# EAGLE design ADC1 (EAGLE 9.6.2)
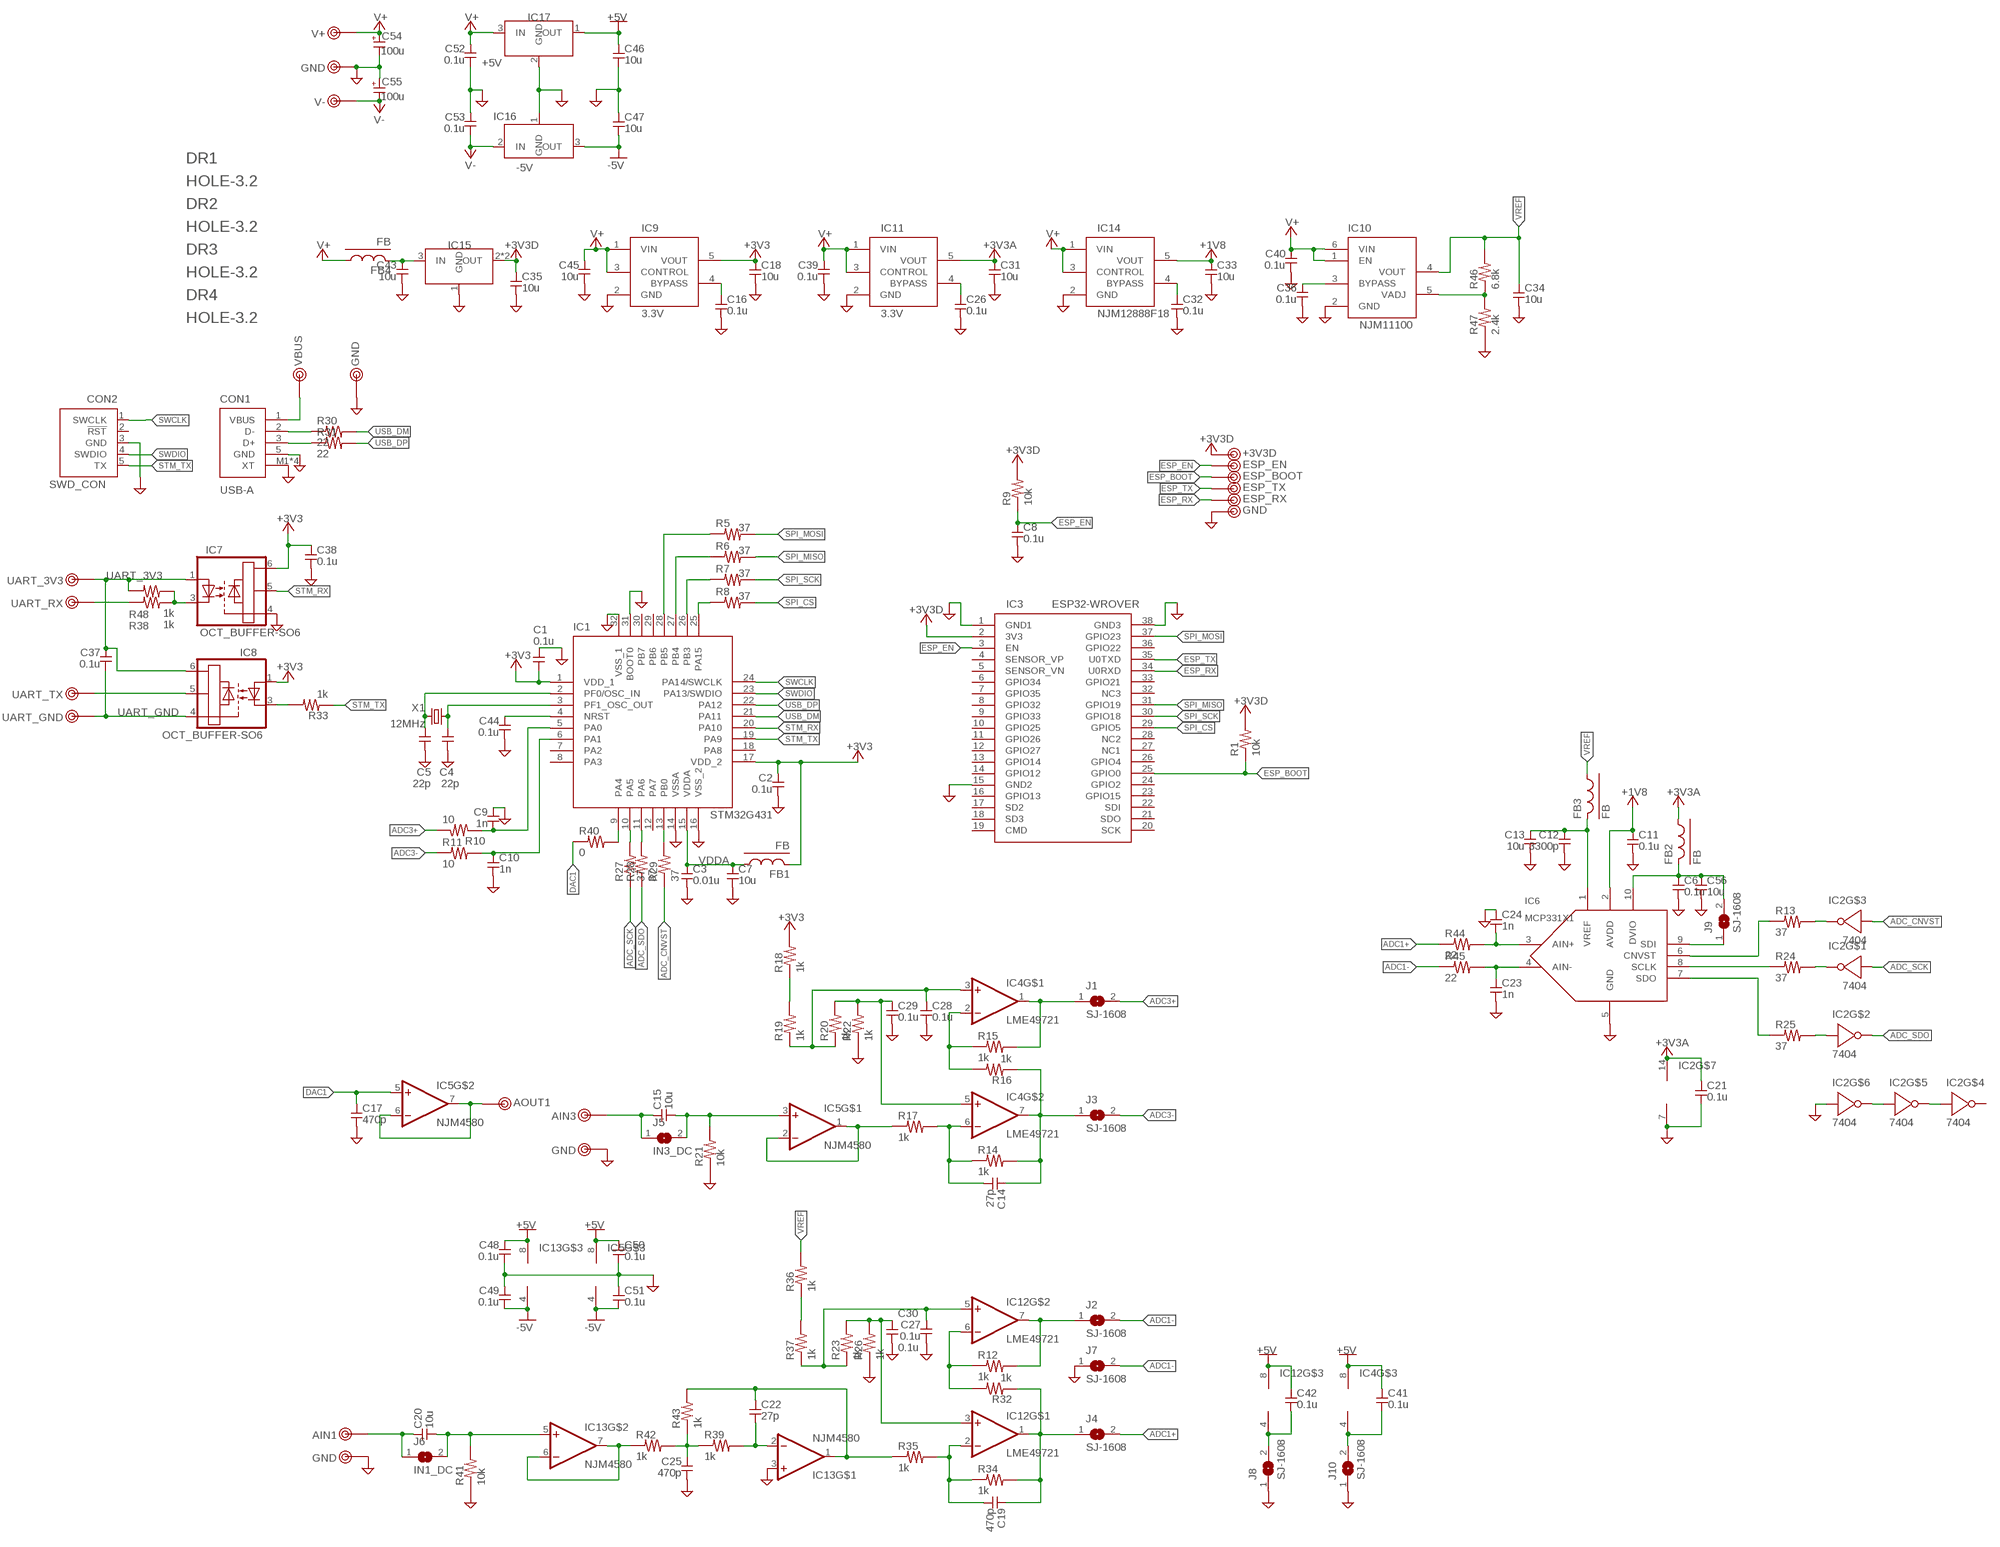
[diagram p0: schematic, sheet 1]

## Parts
C1  0.1u  C-1608  [1608]
C2  0.1u  C-1608  [1608]
C3  0.01u  C-1608  [1608]
C4  22p  C-1608  [1608]
C5  22p  C-1608  [1608]
C6  0.1u  C-1608  [1608]
C7  10u  C-2012  [2012]
C8  0.1u  C-1608  [1608]
C9  1n  C-1608  [1608]
C10  1n  C-1608  [1608]
C11  0.1u  C-1608  [1608]
C12  3300p  C-1608  [1608]
C13  10u  C-2012  [2012]
C14  27p  C-1608  [1608]
C15  10u  C-3225  [3225]
C16  0.1u  C-1608  [1608]
C17  470p  C-1608  [1608]
C18  10u  C-2012  [2012]
C19  470p  C-1608  [1608]
C20  10u  C-3225  [3225]
C21  0.1u  C-1608  [1608]
C22  27p  C-1608  [1608]
C23  1n  C-1608  [1608]
C24  1n  C-1608  [1608]
C25  470p  C-1608  [1608]
C26  0.1u  C-1608  [1608]
C27  0.1u  C-1608  [1608]
C28  0.1u  C-1608  [1608]
C29  0.1u  C-1608  [1608]
C30  0.1u  C-1608  [1608]
C31  10u  C-2012  [2012]
C32  0.1u  C-1608  [1608]
C33  10u  C-2012  [2012]
C34  10u  C-2012  [2012]
C35  10u  C-2012  [2012]
C36  0.1u  C-1608  [1608]
C37  0.1u  C-1608  [1608]
C38  0.1u  C-1608  [1608]
C39  0.1u  C-1608  [1608]
C40  0.1u  C-1608  [1608]
C41  0.1u  C-1608  [1608]
C42  0.1u  C-1608  [1608]
C43  10u  C-2012  [2012]
C44  0.1u  C-1608  [1608]
C45  10u  C-2012  [2012]
C46  10u  C-2012  [2012]
C47  10u  C-2012  [2012]
C48  0.1u  C-1608  [1608]
C49  0.1u  C-1608  [1608]
C50  0.1u  C-1608  [1608]
C51  0.1u  C-1608  [1608]
C52  0.1u  C-1608  [1608]
C53  0.1u  C-1608  [1608]
C54  100u  CPOLE2.5-8  [E2,5-8]
C55  100u  CPOLE2.5-8  [E2,5-8]
C56  10u  C-2012  [2012]
CON1  USB-A  [UX60A-MB-5ST]
CON2  SWD_CON  [SWD_CON]
DR1  HOLE-3.2  [HOLE_3.2]
DR2  HOLE-3.2  [HOLE_3.2]
DR3  HOLE-3.2  [HOLE_3.2]
DR4  HOLE-3.2  [HOLE_3.2]
FB1  FB  [1608-J]
FB2  FB  [1608-J]
FB3  FB  [1608-J]
FB4  FB  [1608-J]
IC1  STM32G431  STM32G431KB  [TQFP32-08]
IC2  7404  [TSSOP14]
IC3  ESP32-WROVER  [ESP32-WROVER]
IC4  LME49721  OPA-2-SOP  [SOP8]
IC5  NJM4580  OPA-2-SOP  [SOP8]
IC6  MCP331X1  [MSOP10]
IC7  OCT_BUFFER-SO6  [SO6]
IC8  OCT_BUFFER-SO6  [SO6]
IC9  3.3V  TAR5SB33  [SOT23-5]
IC10  NJM11100  [SOT23-6]
IC11  3.3V  TAR5SB33  [SOT23-5]
IC12  LME49721  OPA-2-SOP  [SOP8]
IC13  NJM4580  OPA-2-SOP  [SOP8]
IC14  NJM12888F18  NJM12888  [SOT23-5]
IC15  LM1117GS  [SOT223]
IC16  -5V  79LX  [TO-92]
IC17  +5V  78LX  [TO-92]
J1  SJ-1608  [1608-J]
J2  SJ-1608  [1608-J]
J3  SJ-1608  [1608-J]
J4  SJ-1608  [1608-J]
J5  IN3_DC  SJ-2012  [2012-J]
J6  IN1_DC  SJ-2012  [2012-J]
J7  SJ-1608  [1608-J]
J8  SJ-1608  [1608-J]
J9  SJ-1608  [1608-J]
J10  SJ-1608  [1608-J]
R1  10k  R-1608  [1608]
R5  37  R-1608J  [1608-J]
R6  37  R-1608J  [1608-J]
R7  37  R-1608J  [1608-J]
R8  37  R-1608J  [1608-J]
R9  10k  R-1608  [1608]
R10  10  R-1608  [1608]
R11  10  R-1608  [1608]
R12  1k  R-1608  [1608]
R13  37  R-1608J  [1608-J]
R14  1k  R-1608  [1608]
R15  1k  R-1608  [1608]
R16  1k  R-1608  [1608]
R17  1k  R-1608  [1608]
R18  1k  R-1608  [1608]
R19  1k  R-1608  [1608]
R20  1k  R-1608  [1608]
R21  10k  R-1608  [1608]
R22  1k  R-1608  [1608]
R23  1k  R-1608  [1608]
R24  37  R-1608J  [1608-J]
R25  37  R-1608J  [1608-J]
R26  1k  R-1608  [1608]
R27  37  R-1608J  [1608-J]
R28  37  R-1608J  [1608-J]
R29  37  R-1608J  [1608-J]
R30  22  R-1608  [1608]
R31  22  R-1608  [1608]
R32  1k  R-1608  [1608]
R33  1k  R-1608  [1608]
R34  1k  R-1608  [1608]
R35  1k  R-1608  [1608]
R36  1k  R-1608  [1608]
R37  1k  R-1608  [1608]
R38  1k  R-1608  [1608]
R39  1k  R-1608  [1608]
R40  0  R-1608J  [1608-J]
R41  10k  R-1608  [1608]
R42  1k  R-1608  [1608]
R43  1k  R-1608  [1608]
R44  22  R-1608  [1608]
R45  22  R-1608  [1608]
R46  6.8k  R-1608  [1608]
R47  2.4k  R-1608  [1608]
R48  1k  R-1608  [1608]
TP1  AIN3  TESTPIN-BIG  [TESTPIN-BIG]
TP2  AIN1  TESTPIN-BIG  [TESTPIN-BIG]
TP3  AOUT1  TESTPIN-BIG  [TESTPIN-BIG]
TP4  VBUS  TESTPIN  [TESTPIN]
TP5  UART_3V3  TESTPIN  [TESTPIN]
TP6  UART_RX  TESTPIN  [TESTPIN]
TP7  UART_GND  TESTPIN  [TESTPIN]
TP8  UART_TX  TESTPIN  [TESTPIN]
TP9  +3V3D  TESTPIN  [TESTPIN]
TP10  ESP_EN  TESTPIN  [TESTPIN]
TP11  ESP_BOOT  TESTPIN  [TESTPIN]
TP12  ESP_TX  TESTPIN  [TESTPIN]
TP13  GND  TESTPIN  [TESTPIN]
TP14  ESP_RX  TESTPIN  [TESTPIN]
TP15  GND  TESTPIN-BIG  [TESTPIN-BIG]
TP16  GND  TESTPIN-BIG  [TESTPIN-BIG]
TP17  V+  TESTPIN-BIG  [TESTPIN-BIG]
TP18  GND  TESTPIN-BIG  [TESTPIN-BIG]
TP19  V-  TESTPIN-BIG  [TESTPIN-BIG]
TP20  GND  TESTPIN  [TESTPIN]
X1  12MHz  CRYSTALHC49S  [HC49/S]

## Nets
+1V8: C11.1 C33.1 IC6.2(AVDD) IC14.5(VOUT)
+3V3: C1.2 C2.1 C18.1 C38.1 FB1.2 IC1.1(VDD_1) IC1.17(VDD_2) IC7.6(V+) IC8.1(A) IC9.5(VOUT) R18.2
+3V3A: C21.1 C31.1 FB2.1 IC2.14(V+) IC11.5(VOUT)
+3V3D: C35.1 IC3.2(3V3) IC15.2(OUT) IC15.4(OUT) R1.2 R9.2 TP9.1
+5V: C41.1 C42.1 C46.1 C48.1 C50.1 IC4.8(V+) IC5.8(V+) IC12.8(V+) IC13.8(V+) IC17.1(OUT)
-5V: C47.2 C49.2 C51.2 IC5.4(V-) IC13.4(V-) IC16.3(OUT)
ADC1+: J4.2 R44.1
ADC1-: J2.2 J7.2 R45.1
ADC3+: J1.2 R10.1
ADC3-: J3.2 R11.1
ADC_CNVST: IC2.5(IN) R29.1
ADC_SCK: IC2.1(IN) R27.1
ADC_SDO: IC2.4(OUT) R28.1
DAC1: C17.1 IC5.5(+IN) R40.1
ESP_BOOT: IC3.25(GPIO0) R1.1 TP11.1
ESP_EN: C8.1 IC3.3(EN) R9.1 TP10.1
ESP_RX: IC3.34(U0RXD) TP14.1
ESP_TX: IC3.35(U0TXD) TP12.1
GND: C1.1 C2.2 C3.2 C4.2 C5.2 C6.2 C7.2 C8.2 C9.1 C10.2 C11.2 C12.2 C13.2 C16.2 C17.2 C18.2 C21.2 C23.2 C24.1 C25.2 C26.2 C27.2 C28.2 C29.2 C30.2 C31.2 C32.2 C33.2 C34.2 C35.2 C36.2 C38.2 C39.2 C40.2 C43.2 C44.2 C45.2 C46.2 C47.1 C48.2 C49.1 C50.2 C51.1 C52.2 C53.1 C54.- C55.+ C56.2 CON1.5(GND) CON1.M1(XT) CON1.M2(XT) CON1.M3(XT) CON1.M4(XT) CON2.3(GND) IC1.14(VSSA) IC1.16(VSS_2) IC1.31(BOOT0) IC1.32(VSS_1) IC2.7(V-) IC2.13(IN) IC3.1(GND1) IC3.15(GND2) IC3.38(GND3) IC6.5(GND) IC7.4(GND) IC9.2(GND) IC10.2(GND) IC11.2(GND) IC13.3(+IN) IC14.2(GND) IC15.1(GND) IC16.1(GND) IC17.2(GND) J7.1 J8.1 J10.1 R21.1 R22.1 R26.1 R41.1 R47.1 TP13.1 TP15.1 TP16.1 TP18.1 TP20.1
N$1: C5.1 IC1.2(PF0/OSC_IN) X1.2
N$2: C9.2 IC1.5(PA0) R10.2
N$3: C4.1 IC1.3(PF1_OSC_OUT) X1.1
N$4: C25.1 R39.1 R42.2 R43.1
N$5: C10.1 IC1.6(PA1) R11.2
N$6: IC1.26(PB3) R7.1
N$7: IC1.27(PB4) R6.1
N$8: IC1.28(PB5) R5.1
N$9: IC1.13(PB0) R29.2
N$10: C15.1 J5.1 TP1.1
N$11: IC2.11(IN) IC2.12(OUT)
N$12: IC2.9(IN) IC2.10(OUT)
N$14: C28.1 IC4.3(+IN) R19.1 R20.1
N$15: C6.1 C56.1 FB2.2 IC6.10(DVIO) J9.2
N$16: C12.1 C13.1 FB3.2 IC6.1(VREF)
N$17: IC1.25(PA15) R8.1
N$18: IC4.2(-IN) R15.1 R16.2
N$19: IC2.6(OUT) R13.2
N$20: IC2.3(IN) R25.2
N$21: C14.2 IC4.6(-IN) R14.1 R17.2
N$22: C15.2 IC5.3(+IN) J5.2 R21.2
N$23: IC5.1(OUT) IC5.2(-IN) R17.1
N$24: IC5.6(-IN) IC5.7(OUT) TP3.1
N$25: IC6.7(SDO) R25.1
N$26: IC4.1(OUT) J1.1 R15.2
N$27: C14.1 IC4.7(OUT) J3.1 R14.2 R16.1
N$28: IC6.8(SCLK) R24.1
N$29: IC6.6(CNVST) R13.1
N$30: IC6.9(SDI) J9.1
N$31: IC2.2(OUT) R24.2
N$32: CON1.2(D-) R30.1
N$33: CON1.3(D+) R31.1
N$34: IC8.3(C) R33.2
N$35: IC7.3(C) R38.2 R48.2
N$36: IC1.10(PA5) R27.2
N$37: IC1.11(PA6) R28.2
N$38: R36.1 R37.2
N$39: C29.1 IC4.5(+IN) R20.2 R22.2
N$40: R18.1 R19.2
N$41: C27.1 IC12.5(+IN) R23.1 R37.1
N$42: IC12.6(-IN) R12.1 R32.2
N$43: C19.2 IC12.2(-IN) R34.1 R35.2
N$44: C30.1 IC12.3(+IN) R23.2 R26.2
N$45: IC13.6(-IN) IC13.7(OUT) R42.1
N$46: IC12.7(OUT) J2.1 R12.2
N$47: C19.1 IC12.1(OUT) J4.1 R32.1 R34.2
N$48: C20.1 J6.1 TP2.1
N$49: C20.2 IC13.5(+IN) J6.2 R41.2
N$51: C16.1 IC9.4(BYPASS)
N$52: C24.2 IC6.3(AIN+) R44.2
N$53: C23.1 IC6.4(AIN-) R45.2
N$54: IC1.9(PA4) R40.2
N$55: C22.2 IC13.2(-IN) R39.2
N$56: C26.1 IC11.4(BYPASS)
N$57: C22.1 IC13.1(OUT) R35.1 R43.2
N$59: C32.1 IC14.4(BYPASS)
N$61: C36.1 IC10.3(BYPASS)
N$62: IC10.5(VADJ) R46.1 R47.2
N$63: C42.2 IC12.4(V-) J8.2
N$64: C41.2 IC4.4(V-) J10.2
N$65: C43.1 FB4.2 IC15.3(IN)
N$66: C44.1 IC1.4(NRST)
SPI_CS: IC3.29(GPIO5) R8.2
SPI_MISO: IC3.31(GPIO19) R6.2
SPI_MOSI: IC3.37(GPIO23) R5.2
SPI_SCK: IC3.30(GPIO18) R7.2
STM_RX: IC1.20(PA10) IC7.5(OUT)
STM_TX: CON2.5(TX) IC1.19(PA9) R33.1
SWCLK: CON2.1(SWCLK) IC1.24(PA14/SWCLK)
SWDIO: CON2.4(SWDIO) IC1.23(PA13/SWDIO)
UART_3V3: C37.1 IC7.1(A) IC8.6(V+) R48.1 TP5.1
UART_GND: C37.2 IC8.4(GND) TP7.1
UART_RX: R38.1 TP6.1
UART_TX: IC8.5(OUT) TP8.1
USB_DM: IC1.21(PA11) R30.2
USB_DP: IC1.22(PA12) R31.2
V+: C39.1 C40.1 C45.1 C52.1 C54.+ FB4.1 IC9.1(VIN) IC9.3(CONTROL) IC10.1(EN) IC10.6(VIN) IC11.1(VIN) IC11.3(CONTROL) IC14.1(VIN) IC14.3(CONTROL) IC17.3(IN) TP17.1
V-: C53.2 C55.- IC16.2(IN) TP19.1
VBUS: CON1.1(VBUS) TP4.1
VDDA: C3.1 C7.1 FB1.1 IC1.15(VDDA)
VREF: C34.1 FB3.1 IC10.4(VOUT) R36.2 R46.2
Unconnected: CON2.2(!RST) IC1.7(PA2) IC1.8(PA3) IC1.12(PA7) IC1.18(PA8) IC1.29(PB6) IC1.30(PB7) IC2.8(OUT) IC3.4(SENSOR_VP) IC3.5(SENSOR_VN) IC3.6(GPIO34) IC3.7(GPIO35) IC3.8(GPIO32) IC3.9(GPIO33) IC3.10(GPIO25) IC3.11(GPIO26) IC3.12(GPIO27) IC3.13(GPIO14) IC3.14(GPIO12) IC3.16(GPIO13) IC3.17(SD2) IC3.18(SD3) IC3.19(CMD) IC3.20(SCK) IC3.21(SDO) IC3.22(SDI) IC3.23(GPIO15) IC3.24(GPIO2) IC3.26(GPIO4) IC3.27(NC1) IC3.28(NC2) IC3.32(NC3) IC3.33(GPIO21) IC3.36(GPIO22)

## Library data of the parts
C1-C53 C56 = my_rcl:C
C54 C55 = my_rcl:CPOL
CON1 = my_connector:USB
CON2 = my_connector:SWD_CON
DR1-DR4 = my_connector:HOLE-3.2
FB1-FB4 = my_rcl:FB
IC1 = my_ic:STM32G431KB
IC2 = my_ic:7404
IC3 = my_ic:ESP32-WROVER
IC4 IC5 IC12 IC13 = my_ic:OPA-2
IC6 = my_ic:MCP331X1
IC7 IC8 = my_ic:OCT_BUFFER
IC9 IC11 = my_ic:TAR5SB33
IC10 = my_ic:NJM11100
IC14 = my_ic:NJM12888
IC15 = my_ic:LM1117GS
IC16 = my_ic:79LX
IC17 = my_ic:78LX
J1-J10 = my_rcl:SJ
R1 R5-R48 = my_rcl:R
TP1-TP20 = my_connector:TESTPIN
X1 = my_rcl:CRYSTAL: CRYSTAL

## Board
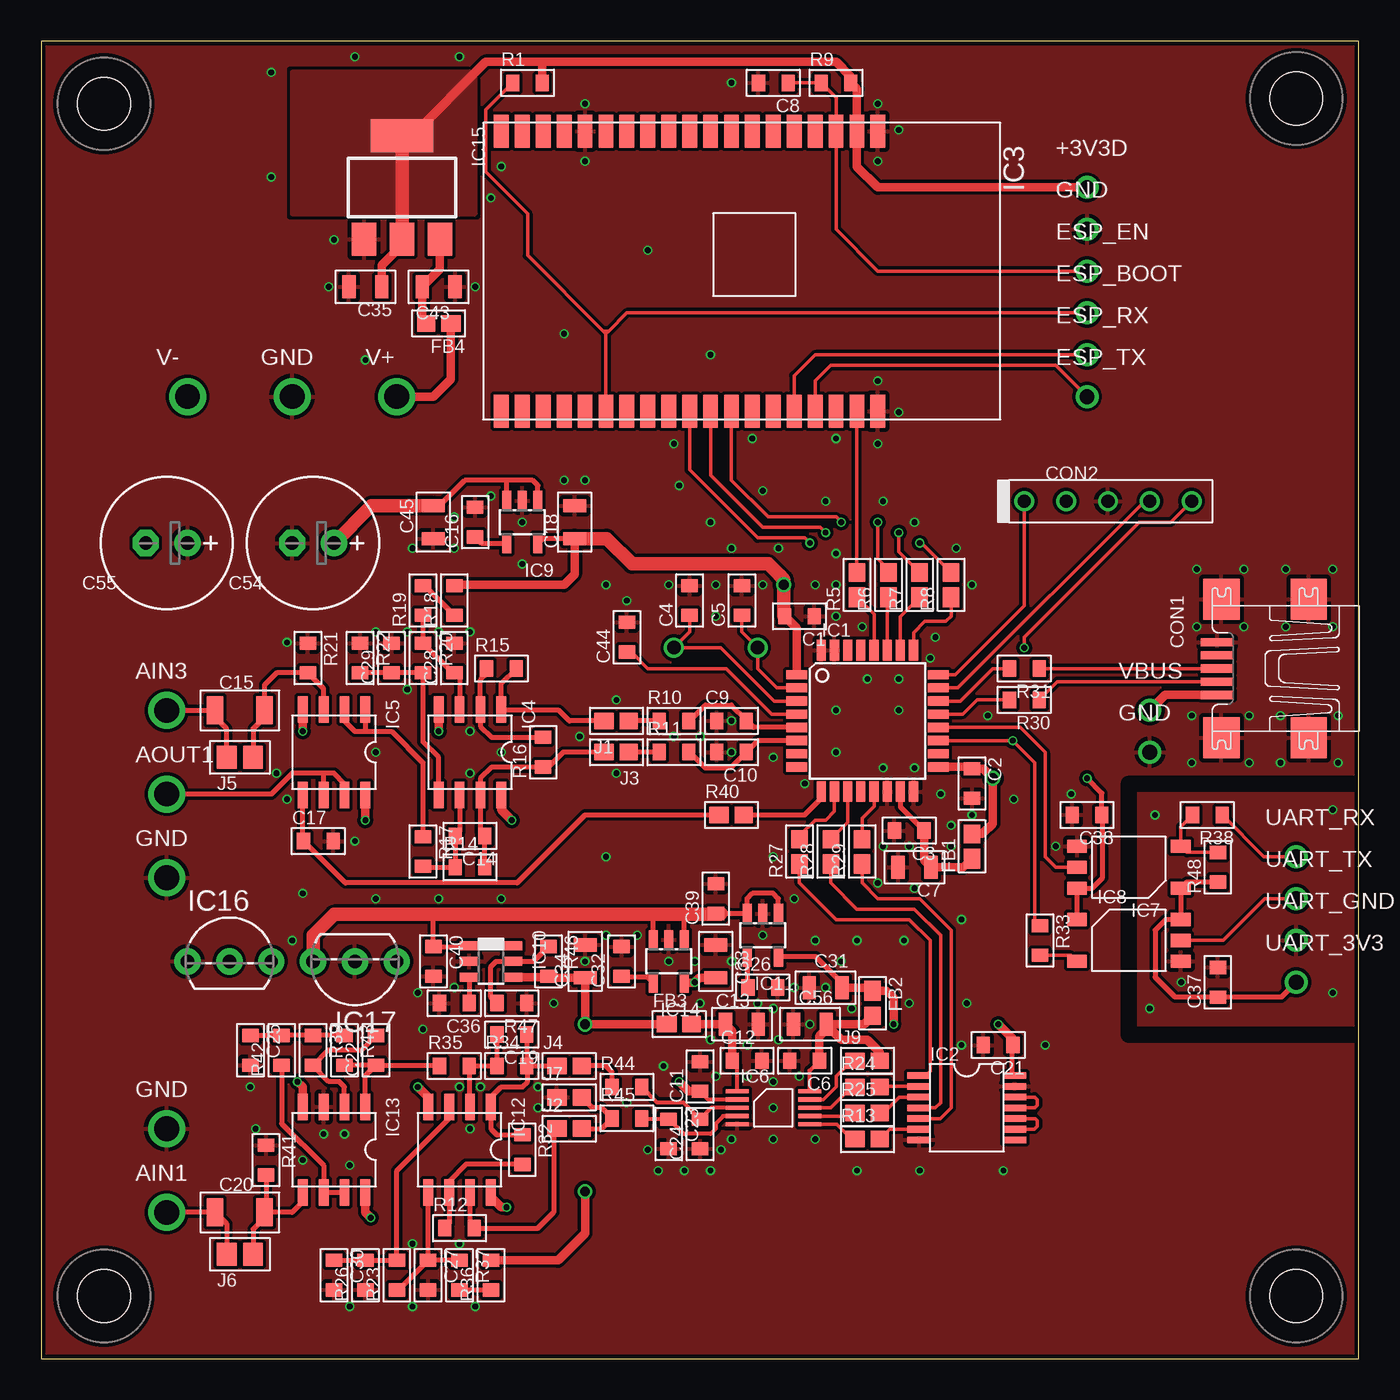
[diagram p1: board, top side]
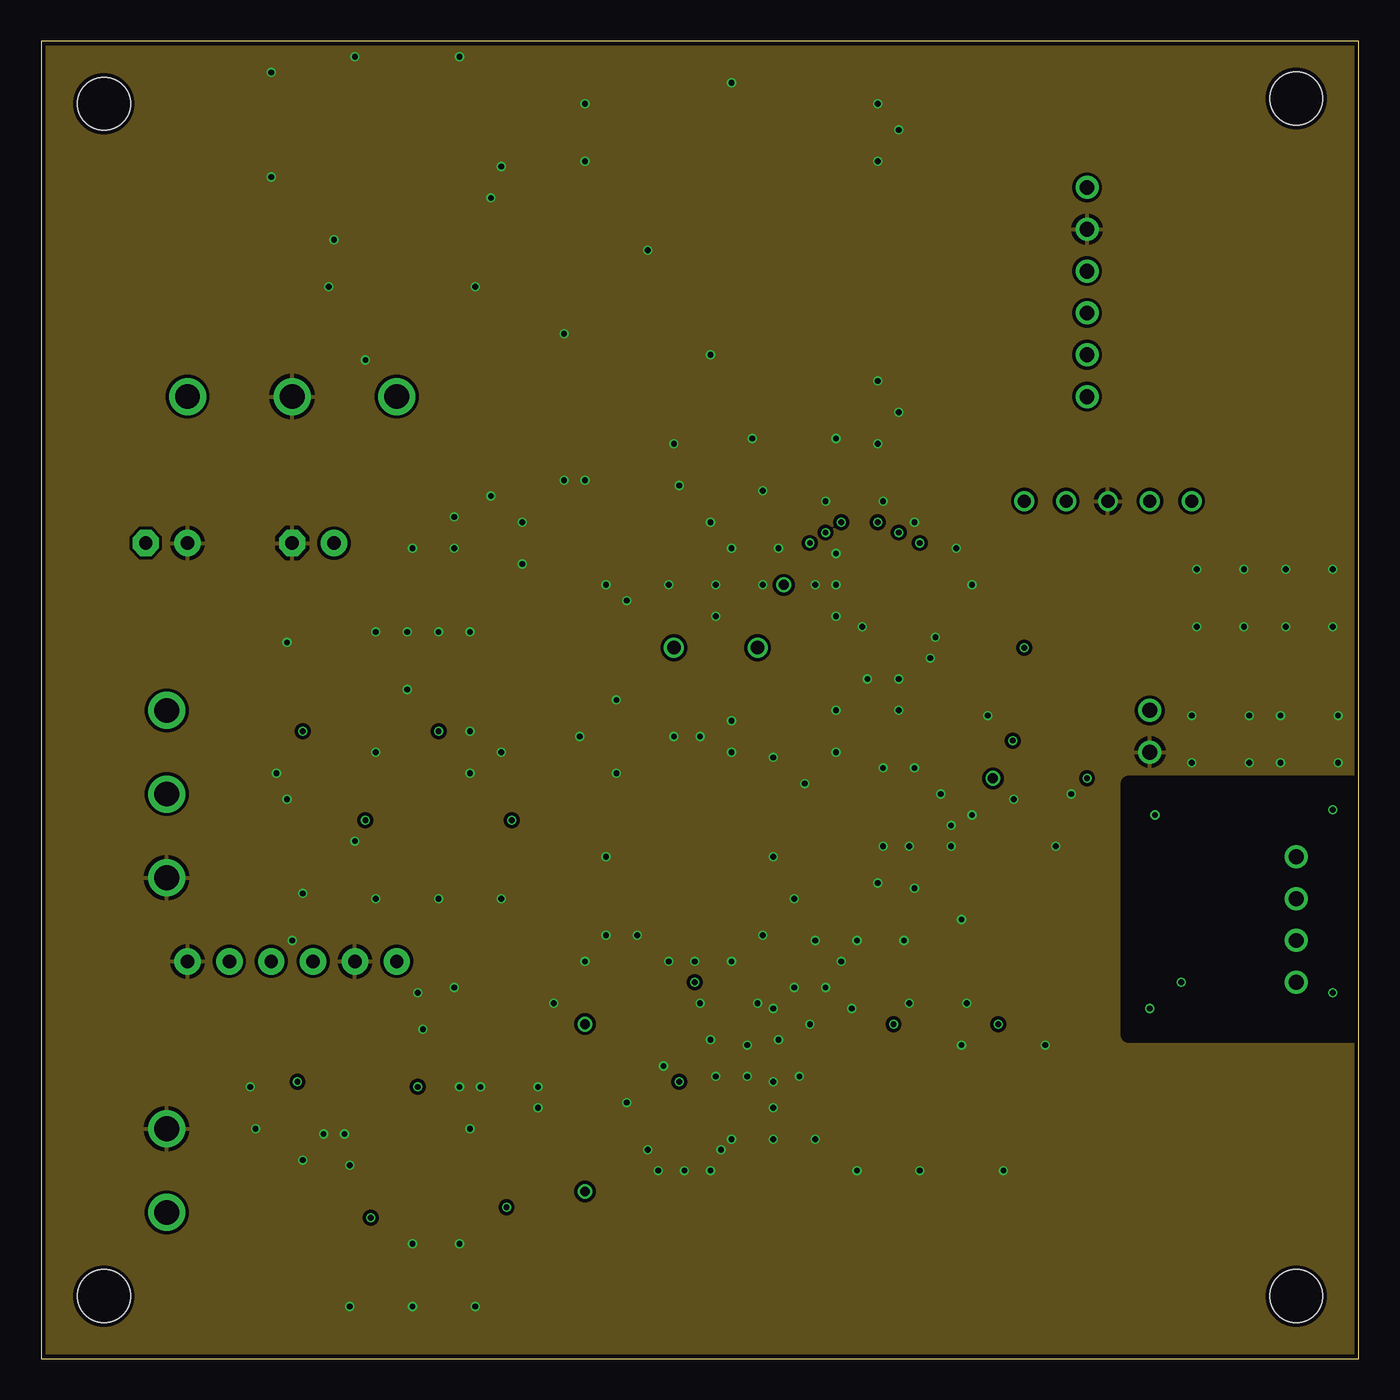
[diagram p2: board, inner layer Route2]
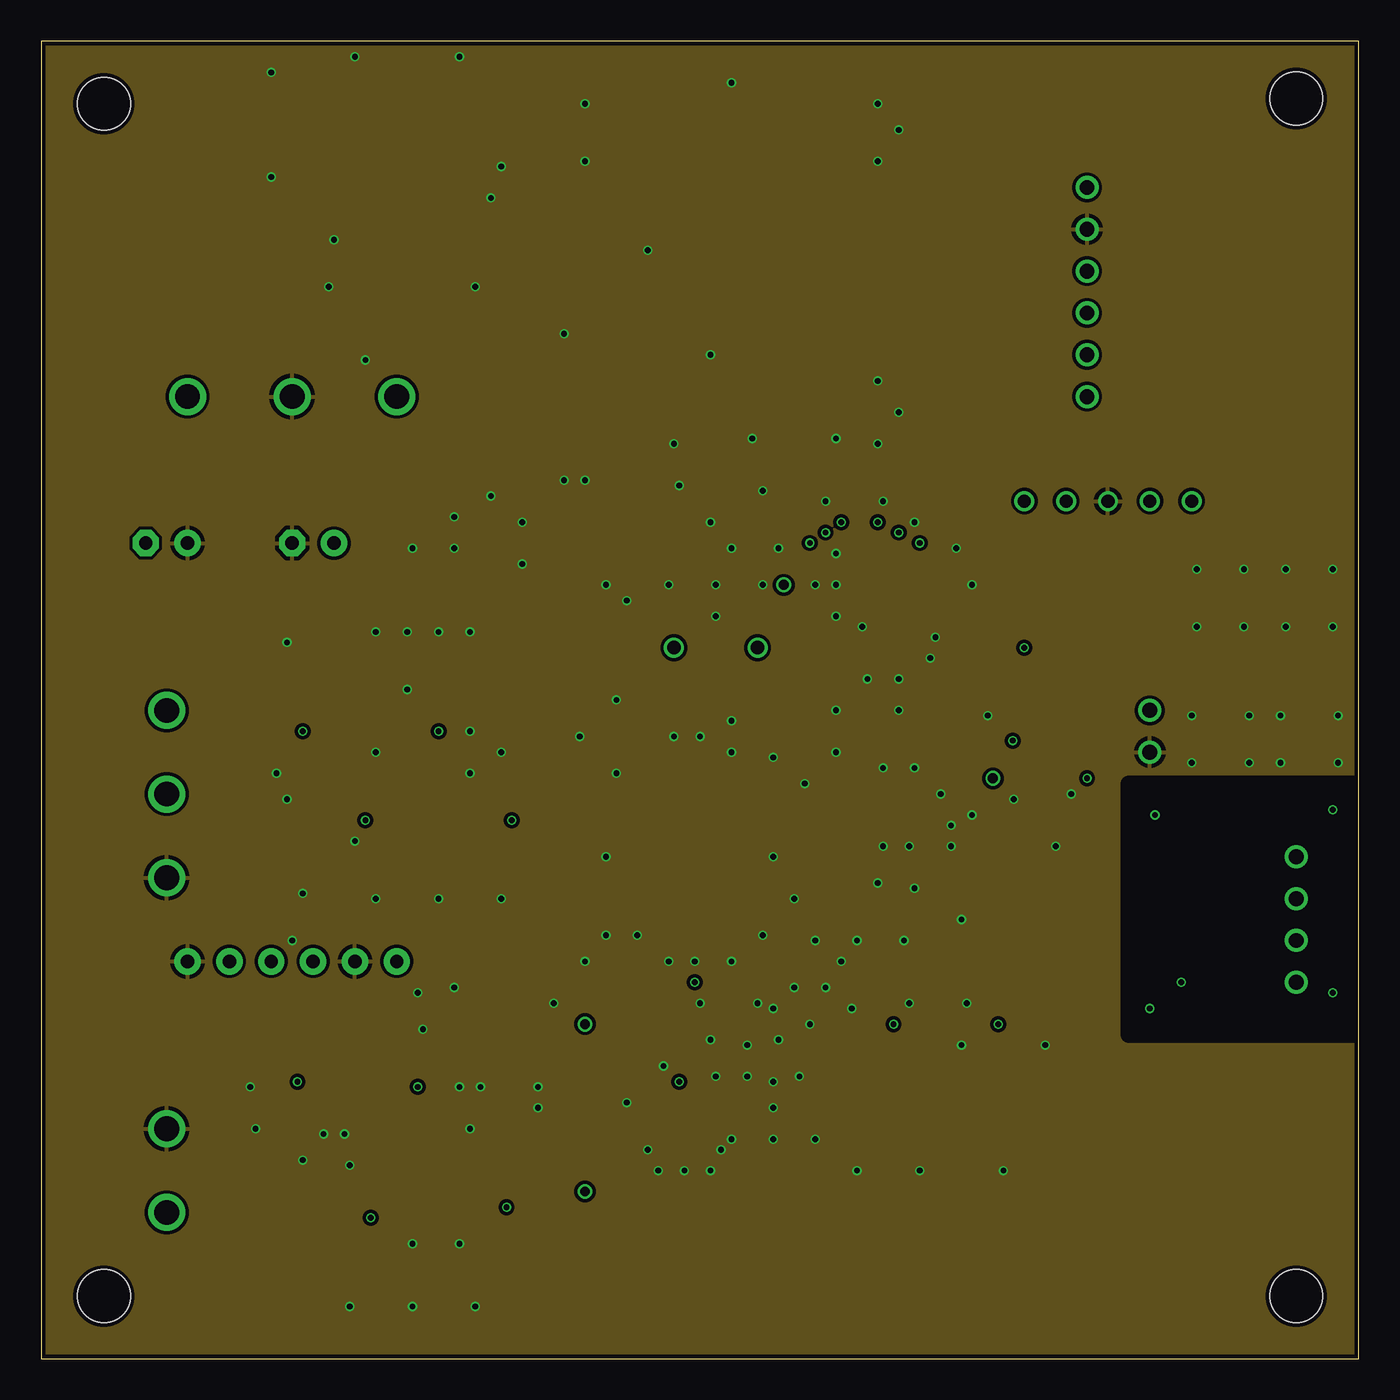
[diagram p3: board, inner layer Route15]
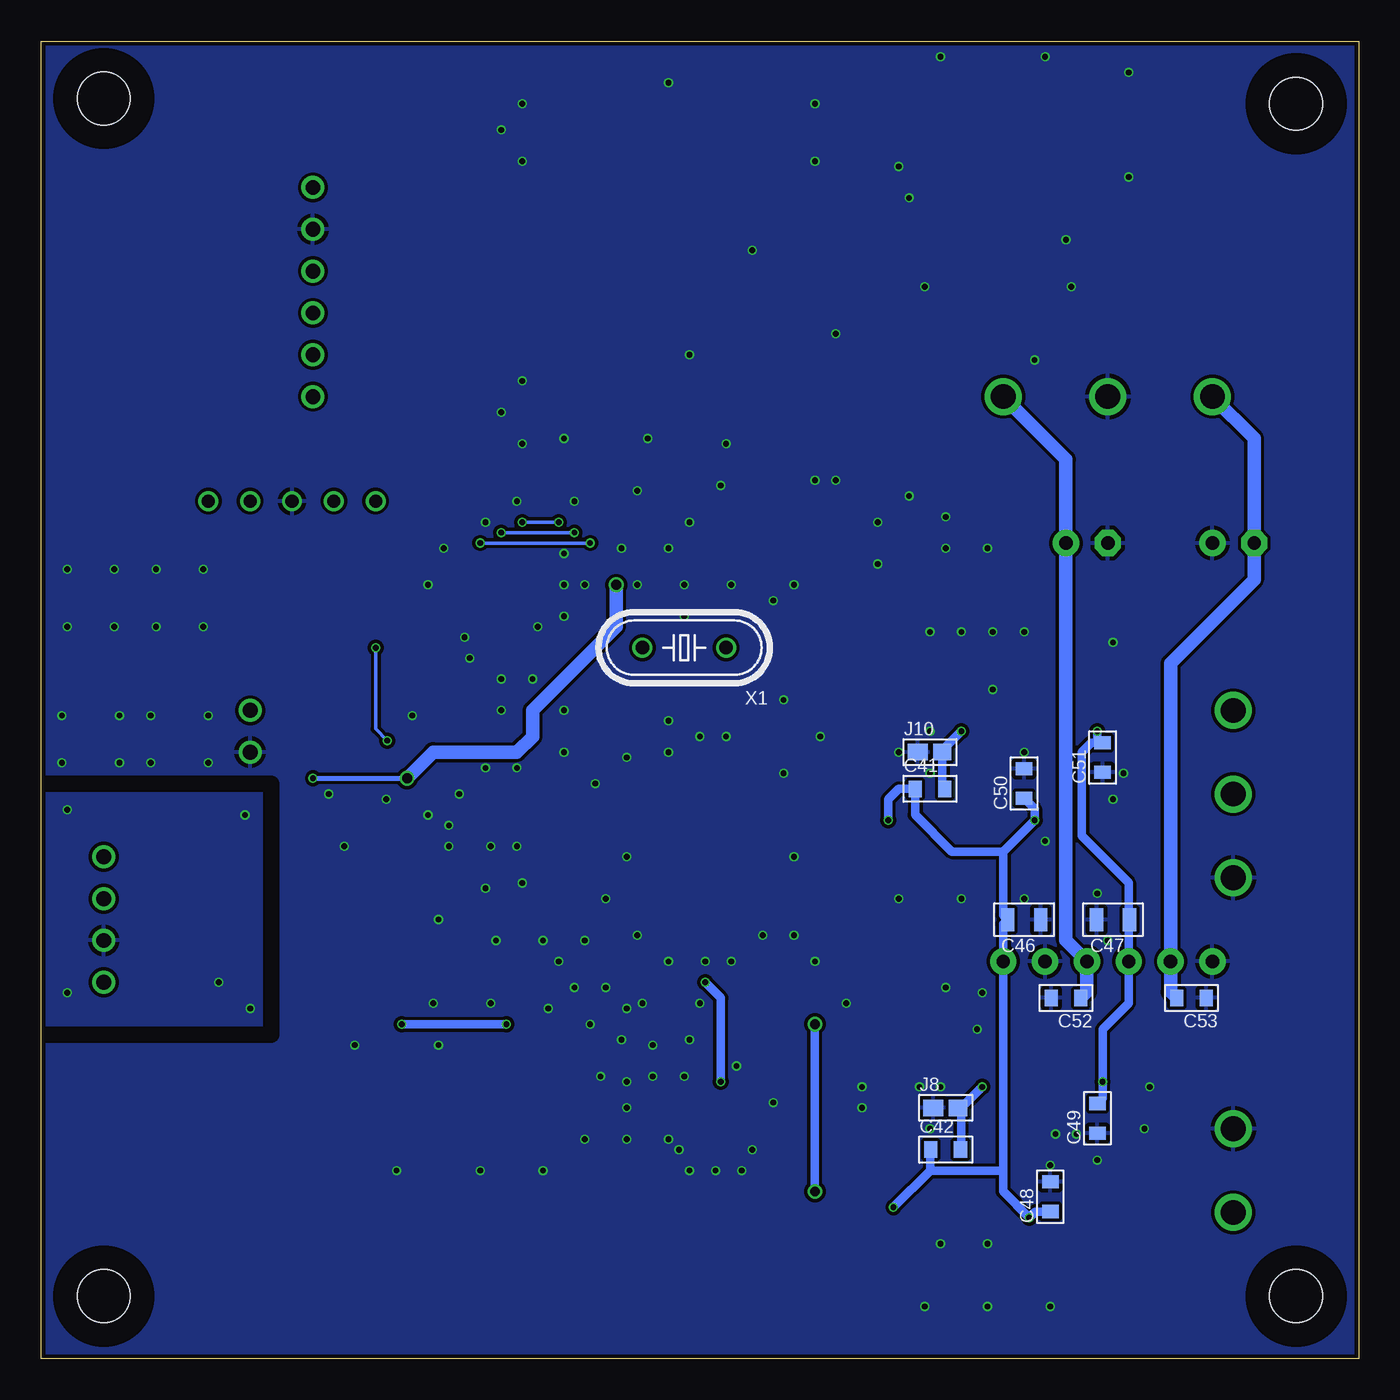
[diagram p4: board, bottom side, seen from below]

Size 80 x 80 mm. Coordinates in mm from the lower left corner, seen from the top.
Outline: 0,0 80,0 80,80 0,80 0,0
Copper layers (1*2*15*16): Top 0.035mm / dielectric 0.2mm / Route2 0.0175mm / dielectric 0.3mm / Route15 0.0175mm / dielectric 0.2mm / Bottom 0.035mm
Design rules "SeeedStudio_4layer_DRU_20140221": minimum track width 8mil, minimum drill 12mil, track to track 8mil, track to pad 8mil, pad to pad 8mil, via to via 8mil, smd to smd 0mil, copper to edge 10mil, drill to drill 8mil, minimum pad ring 6mil, minimum via ring 4mil, stop-mask expansion 4mil, vias tented up to drill 1mm, thermal gap 10mil
tRestrict: 3 lines
bRestrict: 3 lines

### Footprints (pad centres in the part's own frame; a part is rotated, then mirrored left to right if it is on the bottom)
1608 = smd 0.8 x 1: 1 -0.9,0; 2 0.9,0
2012 = smd 0.8 x 1.4: 1 -1,0; 2 1,0
3225 = smd 1 x 1.7: 1 -1.5,0; 2 1.5,0
E2,5-8 = drill 0.813 pad 1.6: + -1.27,0 | drill 0.813 pad 1.6 octagon: - 1.27,0
UX60A-MB-5ST = smd 2 x 0.5: 1 2.25,1.6; 2 2.25,0.8; 3 2.25,0; 4 2.25,-0.8; 5 2.25,-1.6 | smd 2.2 x 2.5: M1 -3.3,-4.2; M2 -3.3,4.2; M3 2,4.2; M4 2,-4.2
SWD_CON = drill 0.8: 1 -5.08,0; 2 -2.54,0; 3 0,0; 4 2.54,0; 5 5.08,0
HOLE_3.2 = hole 3.2: 0,0
1608-J = smd 1.2 x 1: 1 -0.75,0 | smd 1.1 x 1: 2 0.75,0
TQFP32-08 = smd 1.27 x 0.559: 1 -4.293,2.8; 2 -4.293,2; 3 -4.293,1.2; 4 -4.293,0.4; 5 -4.293,-0.4; 6 -4.293,-1.2; 7 -4.293,-2; 8 -4.293,-2.8; 17 4.293,-2.8; 18 4.293,-2; 19 4.293,-1.2; 20 4.293,-0.4; 21 4.293,0.4; 22 4.293,1.2; 23 4.293,2; 24 4.293,2.8 | smd 0.559 x 1.27: 9 -2.8,-4.293; 10 -2,-4.293; 11 -1.2,-4.293; 12 -0.4,-4.293; 13 0.4,-4.293; 14 1.2,-4.293; 15 2,-4.293; 16 2.8,-4.293; 25 2.8,4.293; 26 2,4.293; 27 1.2,4.293; 28 0.4,4.293; 29 -0.4,4.293; 30 -1.2,4.293; 31 -2,4.293; 32 -2.8,4.293
TSSOP14 = smd 0.4 x 1.4: 1 -1.95,-2.9; 2 -1.3,-2.9; 3 -0.65,-2.9; 4 0,-2.9; 5 0.65,-2.9; 6 1.3,-2.9; 7 1.95,-2.9; 8 1.95,2.9; 9 1.3,2.9; 10 0.65,2.9; 11 0,2.9; 12 -0.65,2.9; 13 -1.3,2.9; 14 -1.95,2.9
ESP32-WROVER = smd 2 x 0.9: 1 -8.5,11.43; 2 -8.5,10.16; 3 -8.5,8.89; 4 -8.5,7.62; 5 -8.5,6.35; 6 -8.5,5.08; 7 -8.5,3.81; 8 -8.5,2.54; 9 -8.5,1.27; 10 -8.5,0; 11 -8.5,-1.27; 12 -8.5,-2.54; 13 -8.5,-3.81; 14 -8.5,-5.08; 15 -8.5,-6.35; 16 -8.5,-7.62; 17 -8.5,-8.89; 18 -8.5,-10.16; 19 -8.5,-11.43; 20 8.5,-11.43; 21 8.5,-10.16; 22 8.5,-8.89; 23 8.5,-7.62; 24 8.5,-6.35; 25 8.5,-5.08; 26 8.5,-3.81; 27 8.5,-2.54; 28 8.5,-1.27; 29 8.5,0; 30 8.5,1.27; 31 8.5,2.54; 32 8.5,3.81; 33 8.5,5.08; 34 8.5,6.35; 35 8.5,7.62; 36 8.5,8.89; 37 8.5,10.16; 38 8.5,11.43
SOP8 = smd 0.6 x 1.6: 1 -1.905,-2.6; 2 -0.635,-2.6; 3 0.635,-2.6; 4 1.905,-2.6; 5 1.905,2.6; 6 0.635,2.6; 7 -0.635,2.6; 8 -1.905,2.6
MSOP10 = smd 0.254 x 1.4: 1 -1,-2.2; 2 -0.5,-2.2; 3 0,-2.2; 4 0.5,-2.2; 5 1,-2.2; 6 1,2.2; 7 0.5,2.2; 8 0,2.2; 9 -0.5,2.2; 10 -1,2.2
SO6 = smd 0.8 x 1.2: 1 -1.27,-3.15; 3 1.27,-3.15; 4 1.27,3.15; 5 0,3.15; 6 -1.27,3.15
SOT23-5 = smd 0.55 x 1.2: 1 -0.95,-1.3; 2 0,-1.3; 3 0.95,-1.3; 4 0.95,1.3; 5 -0.95,1.3
SOT23-6 = smd 0.55 x 1.2: 1 -0.95,-1.3; 2 0,-1.3; 3 0.95,-1.3; 4 0.95,1.3; 5 0,1.3; 6 -0.95,1.3
SOT223 = smd 1.5 x 2: 1 -2.3,-3.15; 2 0,-3.15; 3 2.3,-3.15 | smd 3.8 x 2: 4 0,3.15
TO-92 = drill 0.813 pad 1.6: 1 -2.54,0; 2 0,0; 3 2.54,0
2012-J = smd 1.2 x 1.4: 1 -0.8,0; 2 0.8,0
TESTPIN-BIG = drill 1.5: 1 0,0
TESTPIN = drill 0.9 pad 1.4: 1 0,0
HC49/S = drill 0.813: 1 -2.54,0; 2 2.54,0

### Placement (x,y rotation side)
C1  46.04,45.09 180 top
C2  56.52,34.92 270 top
C3  52.7,32.07 180 top
C4  39.37,46.04 90 top
C5  42.55,46.04 90 top
C6  46.35,18.1 180 top
C7  53.02,29.84 180 top
C8  44.45,77.47 180 top
C9  41.91,38.73 0 top
C10  41.91,36.83 180 top
C11  40.01,17.14 90 top
C12  42.86,18.1 0 top
C13  42.55,20.32 0 top
C14  26.04,31.75 180 top
C15  12.06,39.37 0 top
C16  26.35,50.8 90 top
C17  16.83,31.43 0 top
C18  32.38,50.8 90 top
C19  28.57,19.68 180 top
C20  12.06,8.89 0 top
C21  58.1,19.05 180 top
C22  20.32,18.73 90 top
C23  38.1,13.65 270 top
C24  40.01,13.65 90 top
C25  12.7,18.73 270 top
C26  43.81,22.54 0 top
C27  23.5,5.08 270 top
C28  25.08,42.55 90 top
C29  21.27,42.55 90 top
C30  17.78,5.08 270 top
C31  47.62,22.54 180 top
C32  35.24,24.13 90 top
C33  40.96,24.13 90 top
C34  33.02,24.13 90 top
C35  19.68,65.09 180 top
C36  25.08,21.59 180 top
C37  71.44,22.86 90 top
C38  63.5,33.02 180 top
C39  40.96,27.94 90 top
C40  23.81,24.13 270 top
C41  26.04,34.61 0 bottom
C42  25.08,12.7 0 bottom
C43  24.13,65.09 0 top
C44  35.56,43.81 90 top
C45  23.81,50.8 270 top
C46  20.32,26.67 0 bottom
C47  14.92,26.67 0 bottom
C48  18.73,9.84 90 bottom
C49  15.88,14.61 90 bottom
C50  20.32,34.92 90 bottom
C51  15.56,36.51 90 bottom
C52  17.78,21.91 180 bottom
C53  10.16,21.91 180 bottom
C54  16.51,49.53 180 top
C55  7.62,49.53 180 top
C56  46.67,20.32 180 top
CON1  73.66,41.91 180 top
CON2  64.77,52.07 0 top
DR1  3.81,3.81 0 top
DR2  76.2,3.81 0 top
DR3  3.81,76.2 0 top
DR4  76.2,76.52 0 top
FB1  56.52,31.11 90 top
FB2  50.48,21.59 270 top
FB3  38.73,20.32 0 top
FB4  24.13,62.87 180 top
IC1  50.16,38.73 0 top
IC2  56.2,15.24 270 top
IC3  39.37,66.04 270 top
IC4  26.04,36.83 180 top
IC5  17.78,36.83 180 top
IC6  44.45,15.24 270 top
IC7  66.04,29.84 90 top
IC8  66.04,25.4 270 top
IC9  29.21,50.8 180 top
IC10  27.3,24.13 270 top
IC11  43.81,25.72 180 top
IC12  25.4,12.7 180 top
IC13  17.78,12.7 180 top
IC14  38.1,24.13 180 top
IC15  21.91,71.12 0 top
IC16  11.43,24.13 0 top
IC17  19.05,24.13 180 top
J1  34.92,38.73 0 top
J2  32.07,13.97 0 top
J3  34.92,36.83 0 top
J4  32.07,17.78 0 top
J5  12.06,36.51 0 top
J6  12.06,6.35 0 top
J7  32.07,15.88 0 top
J8  25.08,15.24 0 bottom
J9  50.16,18.1 0 top
J10  26.04,36.83 0 bottom
R1  29.53,77.47 0 top
R5  49.53,46.99 90 top
R6  51.44,46.99 90 top
R7  53.34,46.99 90 top
R8  55.24,46.99 90 top
R9  48.26,77.47 0 top
R10  38.42,38.73 0 top
R11  38.42,36.83 0 top
R12  25.4,7.94 0 top
R13  50.16,13.34 0 top
R14  26.04,29.84 0 top
R15  27.94,41.91 0 top
R16  30.48,36.83 90 top
R17  23.18,30.8 270 top
R18  25.08,46.04 90 top
R19  23.18,46.04 90 top
R20  23.18,42.55 270 top
R21  16.19,42.55 270 top
R22  19.37,42.55 270 top
R23  21.59,5.08 90 top
R24  50.16,16.51 0 top
R25  50.16,14.92 0 top
R26  19.68,5.08 90 top
R27  46.04,30.8 90 top
R28  47.94,30.8 90 top
R29  49.85,30.8 90 top
R30  59.69,40.01 180 top
R31  59.69,41.91 180 top
R32  29.21,12.7 270 top
R33  60.64,25.4 270 top
R34  28.57,17.78 0 top
R35  25.08,17.78 0 top
R36  27.3,5.08 90 top
R37  25.4,5.08 270 top
R38  70.8,33.02 180 top
R39  16.51,18.73 270 top
R40  41.91,33.02 0 top
R41  13.65,12.06 270 top
R42  14.61,18.73 90 top
R43  18.41,18.73 270 top
R44  35.56,16.51 0 top
R45  35.56,14.61 0 top
R46  30.8,24.13 270 top
R47  28.57,21.59 180 top
R48  71.44,29.84 90 top
TP1  7.62,39.37 0 top
TP2  7.62,8.89 0 top
TP3  7.62,34.29 0 top
TP4  67.31,39.37 0 top
TP5  76.2,22.86 0 top
TP6  76.2,30.48 0 top
TP7  76.2,25.4 0 top
TP8  76.2,27.94 0 top
TP9  63.5,71.12 0 top
TP10  63.5,66.04 0 top
TP11  63.5,63.5 0 top
TP12  63.5,58.42 0 top
TP13  63.5,68.58 0 top
TP14  63.5,60.96 0 top
TP15  7.62,29.21 0 top
TP16  7.62,13.97 0 top
TP17  21.59,58.42 0 top
TP18  15.24,58.42 0 top
TP19  8.89,58.42 0 top
TP20  67.31,36.83 0 top
X1  40.96,43.18 180 bottom

### Tracks (layer width: path | path; a pad name or v marks a point on that pad's centre or on a via)
+1V8  (via drill 0.35)
  Top 0.254: IC6.2 40.51,15.74 C11.1
  Top 0.508: C11.1 39.32,16.25 v38.73,16.83 | C33.1 39.96,23.13 v39.69,22.86 39.66,22.83 IC14.5
  Bottom 0.508: v38.73,16.83 38.73,21.91 v39.69,22.86
+3V3  (via drill 0.35, 0.6)
  Top 0.305: IC8.1 IC7.6 63.82,28.57 64.45,29.21 64.45,32.97 C38.1 64.4,34.34 v63.5,35.24 | C18.1 30.46,49.8 IC9.5
  Top 0.508: IC1.17 56.41,35.94 C2.1 57.2,35.83 v57.78,35.24 57.78,32.5 57.15,31.86 FB1.2 | IC1.1 45.87,44.35 C1.2 | R18.2 25.14,46.99 31.75,46.99 32.38,47.62 C18.1
  Top 0.813: C1.2 45.09,45.14 v45.09,46.99 45.09,47.31 44.77,47.62 44.13,48.26 35.88,48.26 34.34,49.8 C18.1
  Bottom 0.305: v63.5,35.24 v57.78,35.24
  Bottom 0.813: v45.09,46.99 45.09,44.45 50.16,39.37 50.16,37.78 51.12,36.83 56.2,36.83 v57.78,35.24
+3V3A  (via drill 0.35)
  Top 0.305: C21.1 58.95,19 58.95,17.34 IC2.14 | C31.1 48.62,22.81 47.02,24.42 IC11.5
  Top 0.508: C21.1 59,19.42 v58.1,20.32 | C31.1 50.28,22.54 FB2.1 51.32,22.34 51.75,21.91 v51.75,20.32
  Bottom 0.508: v58.1,20.32 v51.75,20.32
+3V3D
  Top 0.203: 30.43,78.69 30.48,78.74
  Top 0.508: TP9.1 50.8,71.12 49.53,72.39 IC3.2 49.53,77.1 R9.2 49.16,77.84 48.26,78.74 30.48,78.74 26.99,78.74 22.52,74.27 IC15.4 | IC15.2 21.91,67.63 20.68,66.41 C35.1 | R1.2 30.43,78.69
  Top 0.813: IC15.2 IC15.4
  pour Top (no thermals): 26.35,78.11 15.24,78.11 15.24,69.53 26.35,69.53
+5V  (via drill 0.35)
  Top 0.508: IC13.8 19.68,8.89 v20,8.57 | IC12.8 27.3,9.84 27.94,9.21 v28.26,9.21 | IC5.8 v19.68,32.7 | IC4.8 27.94,33.34 v28.57,32.7
  Bottom 0.508: 21.59,11.43 21.59,10.16 v20,8.57 19.63,8.94 C48.1 | 21.59,11.43 IC17.1 21.59,26.4 C46.1 21.59,26.94 21.59,30.8 | 21.59,30.8 v19.68,32.7 19.68,33.39 C50.1 | C42.1 26.04,12.65 26.04,11.43 | 26.04,11.43 v28.26,9.21 | 26.04,11.43 21.59,11.43 | 21.59,30.8 24.71,30.8 26.93,33.02 C41.1 27.94,34.61 28.57,33.97 v28.57,32.7
-5V  (via drill 0.35)
  Top 0.508: IC5.4 v15.88,38.1 | IC13.4 15.88,16.51 v15.56,16.83
  Bottom 0.508: v15.88,38.1 15.88,37.47 15.82,37.41 C51.2 16.25,37.41 16.83,36.83 16.83,31.75 13.97,28.89 13.97,26.72 C47.2 13.97,26.62 IC16.3 13.97,21.59 15.56,20 v15.56,16.83 15.56,15.82 C49.2
ADC1+
  Top 0.305: R44.1 34.66,17.41 34.29,17.78 J4.2
ADC1-
  Top 0.305: J2.2 34.02,13.97 R45.1 34.02,15.24 33.45,15.24 J7.2
ADC3+
  Top 0.305: R10.1 J1.2
ADC3-
  Top 0.305: R11.1 J3.2
ADC_CNVST
  Top 0.203: R29.1 49.85,28.89 50.8,27.94 53.34,27.94 55.24,26.04 55.24,15.24 54.61,14.61 54.59,14.59 IC2.5
ADC_SCK
  Top 0.203: R27.1 46.04,28.89 48.26,26.67 52.7,26.67 53.98,25.4 53.98,17.46 53.7,17.19 IC2.1
ADC_SDO
  Top 0.203: R28.1 47.94,28.89 49.53,27.3 53.02,27.3 54.61,25.72 54.61,15.56 54.29,15.24 IC2.4
DAC1
  Top 0.305: IC5.5 15.88,31.48 C17.1 18.47,28.89 28.89,28.89 33.02,33.02 R40.1
ESP_BOOT
  Top 0.203: TP11.1 35.56,63.5 34.45,62.39 | 34.45,62.39 34.29,62.23 | 34.29,62.23 IC3.25 | R1.1 26.99,75.83 26.99,72.07 29.53,69.53 29.53,66.99 34.13,62.39 | 34.13,62.39 34.29,62.23 | 34.13,62.39 34.45,62.39
ESP_EN
  Top 0.203: TP10.1 50.8,66.04 48.26,68.58 IC3.3 48.26,76.57 R9.1 C8.1
ESP_RX
  Top 0.203: TP14.1 46.99,60.96 45.72,59.69 IC3.34
ESP_TX
  Top 0.203: IC3.35 46.99,59.37 47.94,60.33 61.59,60.33 TP12.1
GND  (via drill 0.35)
  other vias: 56.52,33.02 55.24,31.11 52.7,31.11 53.02,28.57 50.8,28.89 55.24,32.38 59.05,33.97 62.55,34.29 61.59,31.11 41.91,13.34 44.45,13.34 46.99,13.34 42.86,19.05 44.77,19.37 40.96,17.14 40.64,19.37 44.45,15.24 44.45,16.83 40.64,11.43 39.05,11.43 37.47,11.43 38.1,24.13 49.53,25.4 43.81,25.72 33.02,24.13 23.18,20 18.73,3.17 22.54,3.17 26.35,3.17 25.4,6.99 18.41,13.65 12.7,16.51 22.86,22.23 31.11,21.59 20.32,27.94 24.13,27.94 27.94,27.94 41.91,38.73 41.91,36.83 40.01,37.78 38.42,37.78 44.45,36.51 40.96,46.99 43.81,46.99 38.1,46.99 40.96,45.09 35.56,46.04 20.32,44.13 22.23,44.13 24.13,44.13 26.04,44.13 22.23,40.64 14.92,43.5 27.94,36.83 26.04,38.1 26.04,35.56 26.04,13.97 26.67,16.51 25.4,16.51 13.02,13.97 30.16,16.51 30.16,15.24 35.56,15.56 36.83,12.7 41.27,12.7 37.78,17.78 36.2,25.72 34.29,25.72 25.08,22.54 52.7,21.59 56.2,21.59 55.88,19.05 53.34,11.43 58.42,11.43 60.96,19.05 48.26,45.09 46.99,46.99 48.26,46.99 44.77,49.21 41.91,49.21 40.64,50.8 43.18,55.88 47.62,52.07 43.81,52.7 48.26,55.88 38.42,55.56 50.8,55.56 51.12,52.07 53.02,50.8 55.56,49.21 49.85,44.45 54.29,43.81 56.52,46.99 53.98,42.55 46.35,34.92 51.12,31.11 57.47,39.05 41.91,77.47 33.02,76.2 33.02,72.71 52.07,57.47 33.02,53.34 29.21,50.8 25.08,51.12 22.54,49.21 25.08,49.21 43.5,21.59 40.01,21.59 32.7,37.78 34.92,40.01 34.92,35.56 69.85,36.2 73.34,36.2 73.34,39.05 75.25,39.05 75.25,36.2 78.74,36.2 78.74,39.05 70.17,47.94 73.03,47.94 73.03,44.45 70.17,44.45 75.56,44.45 78.42,44.45 78.42,47.94 75.56,47.94 69.85,39.05 22.54,6.99 50.8,59.37 19.05,31.43 15.88,28.26 15.24,25.4 14.29,35.56 20.32,36.83 15.88,12.06 18.73,11.75 17.14,13.65 42.86,17.14 46.04,17.14 49.53,11.43 34.29,30.48 50.8,76.2 52.07,74.61 50.8,72.71 48.26,39.37 48.26,36.83 52.07,39.37 52.07,41.27 50.16,41.27 54.61,34.29 53.02,35.88 51.12,35.88 45.72,22.54 48.58,24.13 46.99,25.4 41.91,24.13 39.69,24.13 31.75,53.34 29.21,48.26 34.29,46.99 27.3,52.39 45.72,27.94 44.45,30.48 17.78,67.94 13.97,71.75 13.97,78.11 19.05,79.06 25.4,79.06 27.94,72.39 26.35,65.09 17.46,65.09 19.68,60.64 47.62,22.54 49.21,21.27 46.67,20.32 44.45,21.27 14.92,33.97 52.39,25.4 55.88,26.67 38.73,53.02 48.26,48.9 27.3,70.48 36.83,67.31 31.75,62.23 40.64,60.96
  pour Top (rank 4): 0,80.01 0,0 80.01,0 80.01,80.01
  pour Bottom (rank 4): 0,80.01 0,0 80.01,0 80.01,80.01
  pour Route2 (rank 3): 0,0 0,80.01 80.01,80.01 80.01,0
  pour Route15 (rank 3): 0,0 80.01,0 80.01,80.01 0,80.01
N$1
  Top 0.203: C5.1 42.55,44.13 X1.2 43.5,41.91 44.67,40.73 IC1.2
N$2
  Top 0.305: R10.2 39.37,38.73 40.32,39.69 41.91,39.69 42.81,38.79 | 42.81,38.79 C9.2 | IC1.5 43.26,38.34 42.81,38.79
N$3
  Top 0.203: C4.1 39.37,44.13 X1.1 41.27,43.18 44.52,39.94 IC1.3
N$4
  Top 0.305: R43.1 R39.1 R42.2 C25.1
N$5
  Top 0.305: R11.2 39.37,36.83 40.32,35.88 41.86,35.88 C10.1 43.52,37.53 IC1.6
N$6
  Top 0.203: R7.1 52.16,45.06 IC1.26
N$7
  Top 0.203: R6.1 51.37,46.17 IC1.27
N$8
  Top 0.203: R5.1 50.56,45.2 IC1.28
N$9
  Top 0.203: IC1.13 50.56,33.53 49.85,32.82 R29.2
N$10
  Top 0.305: J5.1 11.27,38.27 10.56,38.97 C15.1 TP1.1
N$11
  Top 0.203: IC2.12 60.31,15.89 60.48,15.72 60.48,15.4 60.33,15.24 IC2.11
N$12
  Top 0.203: IC2.10 60.34,14.59 60.48,14.45 60.48,14.13 60.3,13.94 IC2.9
N$14
  Top 0.305: R19.1 R20.1 24.98,41.65 C28.1 25.4,41.33 IC4.3
N$15
  Top 0.254: IC6.10 46.65,17.49 C6.1
  Top 0.508: C6.1 47.26,19.59 47.81,20.14 | J9.2 50.91,18.62 50.16,19.37 48.58,19.37 47.81,20.14 | 47.81,20.14 47.65,20.3 C56.1 49.96,20.32 FB2.2
N$16
  Top 0.254: IC6.1 42.25,17.81 C12.1
  Top 0.508: C12.1 41.96,19.9 C13.1 FB3.2
N$17
  Top 0.203: R8.1 55.24,45.09 54.93,44.77 53.66,44.77 52.97,44.08 IC1.25
N$18
  Top 0.305: R15.1 27.04,41.59 26.67,41.22 IC4.2 26.67,38.42 27.36,37.73 R16.2
N$19
  Top 0.203: R13.2 51.52,13.94 IC2.6
N$20
  Top 0.203: R25.2 51.12,14.92 52.09,15.89 IC2.3
N$21
  Top 0.305: IC4.6 25.4,32.02 C14.2 R14.1 23.23,29.84 R17.2
N$22
  Top 0.305: IC5.3 17.14,40.69 R21.2 14.29,41.65 13.56,40.92 C15.2 13.56,38.97 12.87,38.27 J5.2
N$23
  Top 0.305: R17.1 23.18,36.2 21.27,38.1 19.68,38.1 | IC5.2 18.41,38.73 19.05,38.1 19.68,38.1 | IC5.1 19.68,38.1
N$24
  Top 0.305: IC5.6 17.14,35.56 | 17.14,35.56 15.24,35.56 13.97,34.29 TP3.1 | IC5.7 18.41,34.92 17.78,35.56 17.14,35.56
N$25
  Top 0.203: IC6.7 49.23,14.74 R25.1
N$26
  Top 0.305: R15.2 27.94,41.01 IC4.1 28,39.37 31.43,39.37 32.07,38.73 J1.1
N$27
  Top 0.305: J3.1 31.7,36.83 30.8,35.93 R16.1 27.36,35.93 26.67,35.24 IC4.7 26.67,32.02 C14.1 R14.2
N$28
  Top 0.203: IC6.8 47.94,15.24 49.21,16.51 R24.1
N$29
  Top 0.203: IC6.6 48.31,14.24 49.21,13.34 R13.1
N$30
  Top 0.203: IC6.9 47.49,15.74 48.26,16.51 48.26,17.14 49.21,18.1 J9.1
N$31
  Top 0.203: IC2.2 50.95,16.54 R24.2
N$32
  Top 0.203: CON1.2 61.7,41.11 R30.1
N$33
  Top 0.203: CON1.3 R31.1
N$34
  Top 0.203: IC8.3 62.52,24.5 R33.2
N$35
  Top 0.203: R48.2 69.56,30.75 IC7.3 69.19,32.31 R38.2
N$36
  Top 0.203: R27.2 46.04,31.75 46.99,32.7 47.62,32.7 48.16,33.24 IC1.10
N$37
  Top 0.203: IC1.11 48.97,32.57 R28.2
N$38
  Top 0.305: R37.2 R36.1
N$39
  Top 0.305: R22.2 C29.1 R20.2 23.18,37.47 24.13,36.51 IC4.5
N$40
  Top 0.305: R18.1 23.28,46.94 R19.2
N$41
  Top 0.305: R37.1 C27.1 | C27.1 21.7,4.18 R23.1 | C27.1 IC12.5
N$42
  Top 0.305: R32.2 25.77,11.8 24.77,10.79 IC12.6 24.77,8.2 R12.1
N$43
  Top 0.305: IC12.2 26.04,17.73 R35.2 R34.1 C19.2
N$44
  Top 0.305: C30.1 R26.2 R23.2 21.59,11.43 24.77,14.61 IC12.3
N$45
  Top 0.305: R42.1 14.61,14.29 17.14,11.75 IC13.6 IC13.7
N$46
  Top 0.305: IC12.7 26.04,8.2 R12.2 30.16,7.94 31.11,8.89 31.11,13.77 J2.1
N$47
  Top 0.305: 29.53,17.46 29.53,16.83 29.21,16.51 27.94,16.51 27.3,15.88 IC12.1 27.3,13.97 27.68,13.6 R32.1 | 29.53,17.46 29.53,17.73 R34.2 J4.1 | C19.1 29.48,17.52 29.53,17.46
N$48
  Top 0.305: TP2.1 C20.1 11.27,8.19 J6.1
N$49
  Top 0.305: IC13.5 15.88,9.53 15.24,8.89 13.65,8.89 | 13.65,8.89 C20.2 13.56,8.57 12.87,7.87 J6.2 | R41.2 13.65,8.89
N$51
  Top 0.305: IC9.4 26.75,49.5 C16.1
N$52
  Top 0.254: IC6.3 40.69,15.24 C24.2 39,15.56 37.41,15.56 R44.2
N$53
  Top 0.254: IC6.4 41.41,14.74 40.96,14.29 40.96,13.97 40.64,13.65 39,13.65 C23.1 36.51,14.55 R45.2
N$54
  Top 0.305: R40.2 46.35,33.02 47.37,34.03 IC1.9
N$55
  Top 0.305: C22.2 19.42,18.73 17.41,18.73 R39.2 16.51,17.78 17.46,16.83 18.1,16.83 18.41,16.51 IC13.2
N$56
  Top 0.305: IC11.4 42.87,22.59 C26.1
N$57
  Top 0.305: IC13.1 19.68,17.2 C22.1 | C22.1 R43.2 | R35.1 20.37,17.78 C22.1
N$59
  Top 0.305: IC14.4 36.8,23.18 35.3,23.18 C32.1
N$61
  Top 0.305: C36.1 26,21.61 IC10.3
N$62
  Top 0.305: R46.1 29.9,24.13 IC10.5 27.62,24.13 27.3,23.81 27.3,21.96 R47.2
N$63  (via drill 0.35)
  Top 0.508: IC12.4 23.5,15.88 v22.86,16.51
  Bottom 0.508: v22.86,16.51 24.13,15.24 | 24.13,15.24 J8.2 | C42.2 24.13,12.75 24.13,15.24
N$64  (via drill 0.35)
  Top 0.508: IC4.4 v24.13,38.1
  Bottom 0.508: v24.13,38.1 25.29,36.95 J10.2 25.29,34.76 C41.2
N$65
  Top 0.508: IC15.3 24.21,66.17 C43.1 23.13,63.12 FB4.2
N$66
  Top 0.203: IC1.4 44.37,39.13 41.59,41.91 36.83,41.91 35.83,42.91 C44.1
N$67
  cutout Route15: 79.69,19.68 66.04,19.68 66.04,34.92 80.01,34.92 80.01,19.68
N$68
  cutout Route2: 66.04,19.68 80.01,19.68 80.01,34.92 66.04,34.92
SPI_CS  (via drill 0.35)
  Top 0.203: v53.34,49.53 53.45,49.53 R8.2 | v46.67,49.53 46.35,49.85 43.5,49.85 39.37,53.98 IC3.29
  Bottom 0.203: v46.67,49.53 v53.34,49.53
SPI_MISO  (via drill 0.35)
  Top 0.203: R6.2 51.54,47.84 50.8,48.58 v50.8,50.8 | v48.58,50.8 48.26,51.12 44.13,51.12 41.91,53.34 IC3.31
  Bottom 0.203: v48.58,50.8 v50.8,50.8
SPI_MOSI
  Top 0.203: R5.2 IC3.37
SPI_SCK  (via drill 0.35)
  Top 0.203: v52.07,50.16 52.07,49.01 R7.2 | v47.62,50.16 47.31,50.48 43.81,50.48 40.64,53.66 IC3.30
  Bottom 0.203: v47.62,50.16 v52.07,50.16
STM_RX
  Top 0.203: IC1.20 59.45,38.34 60.96,36.83 60.96,30.48 61.59,29.84 IC7.5
STM_TX  (via drill 0.35)
  Top 0.203: IC1.19 v58.98,37.53 60.33,36.2 60.33,26.62 R33.1 | v59.69,43.18 59.69,43.81 66.67,50.8 68.58,50.8 CON2.5
  Bottom 0.203: v59.69,43.18 59.69,38.24 v58.98,37.53
SWCLK
  Top 0.203: IC1.24 55.51,41.53 59.69,45.72 CON2.1
SWDIO
  Top 0.203: IC1.23 55.66,40.73 66.99,52.07 CON2.4
UART_3V3
  Top 0.203: 69.36,28.75 IC7.1
  Top 0.305: R48.1 69.56,28.95 69.36,28.75 | IC7.1 IC8.6 68.26,26.67 67.63,26.04 67.63,23.18 68.84,21.96 C37.1 75.3,21.96 TP5.1
UART_GND  (via drill 0.35)
  other vias: 69.22,22.86 67.63,33.02 78.42,33.34 78.42,22.23 67.31,21.27
  pour Top: 80.01,34.61 66.36,34.61 66.36,20 80.01,20
  pour Bottom: 80.01,20 66.36,20 66.36,34.61 80.01,34.61
UART_RX
  Top 0.203: R38.1 74.24,30.48 TP6.1
UART_TX
  Top 0.203: IC8.5 71.75,25.4 74.3,27.94 TP8.1
USB_DM
  Top 0.203: IC1.21 55.96,39.13 56.83,40.01 R30.2
USB_DP
  Top 0.203: IC1.22 55.81,39.94 57.78,41.91 R31.2
V+
  Top 0.305: IC10.6 IC10.1 25.95,25.03 C40.1 23.81,26.99 | 41.27,27.04 C39.1 | IC14.1 39.05,26.99 | IC14.3 37.15,26.99 | IC11.1 44.77,27.94 44.45,28.26 43.18,28.26 42.87,27.94 IC11.3 41.25,27.02 41.22,26.99 | IC9.1 30.16,53.02 29.84,53.34 28.26,53.34 | 28.26,53.34 25.72,53.34 24.18,51.8 C45.1 | IC9.3 28.26,53.34
  Top 0.508: FB4.1 24.88,59.49 23.81,58.42 TP17.1
  Top 0.813: 41.27,27.04 41.22,26.99 39.05,26.99 37.15,26.99 23.81,26.99 17.78,26.99 16.51,25.72 IC17.3 | C45.1 20.05,51.8 C54.+
  Bottom 0.813: C52.1 16.51,22.28 IC17.3 17.78,25.4 C54.+ 17.78,54.61 TP17.1
V-
  Bottom 0.813: C53.2 11.43,22.28 IC16.2 11.43,42.23 6.35,47.31 C55.- 6.35,55.88 TP19.1
VBUS
  Top 0.508: CON1.1 68.25,40.31 TP4.1
VDDA
  Top 0.305: IC1.15 52.16,33.51 C3.1 | 54,29.87 C7.1
  Top 0.508: C3.1 53.6,30.26 54,29.87 | C7.1 55.99,29.84 FB1.1
VREF  (via drill 0.6)
  Top 0.508: FB3.1 v33.02,20.32 C34.1 30.9,23.13 R46.2 30.75,23.18 IC10.4 | R36.2 31.38,5.98 33.02,7.62 v33.02,10.16
  Bottom 0.508: v33.02,10.16 v33.02,20.32